# EAGLE design PFC_Method_AirSens_V1 (EAGLE 9.2.2)
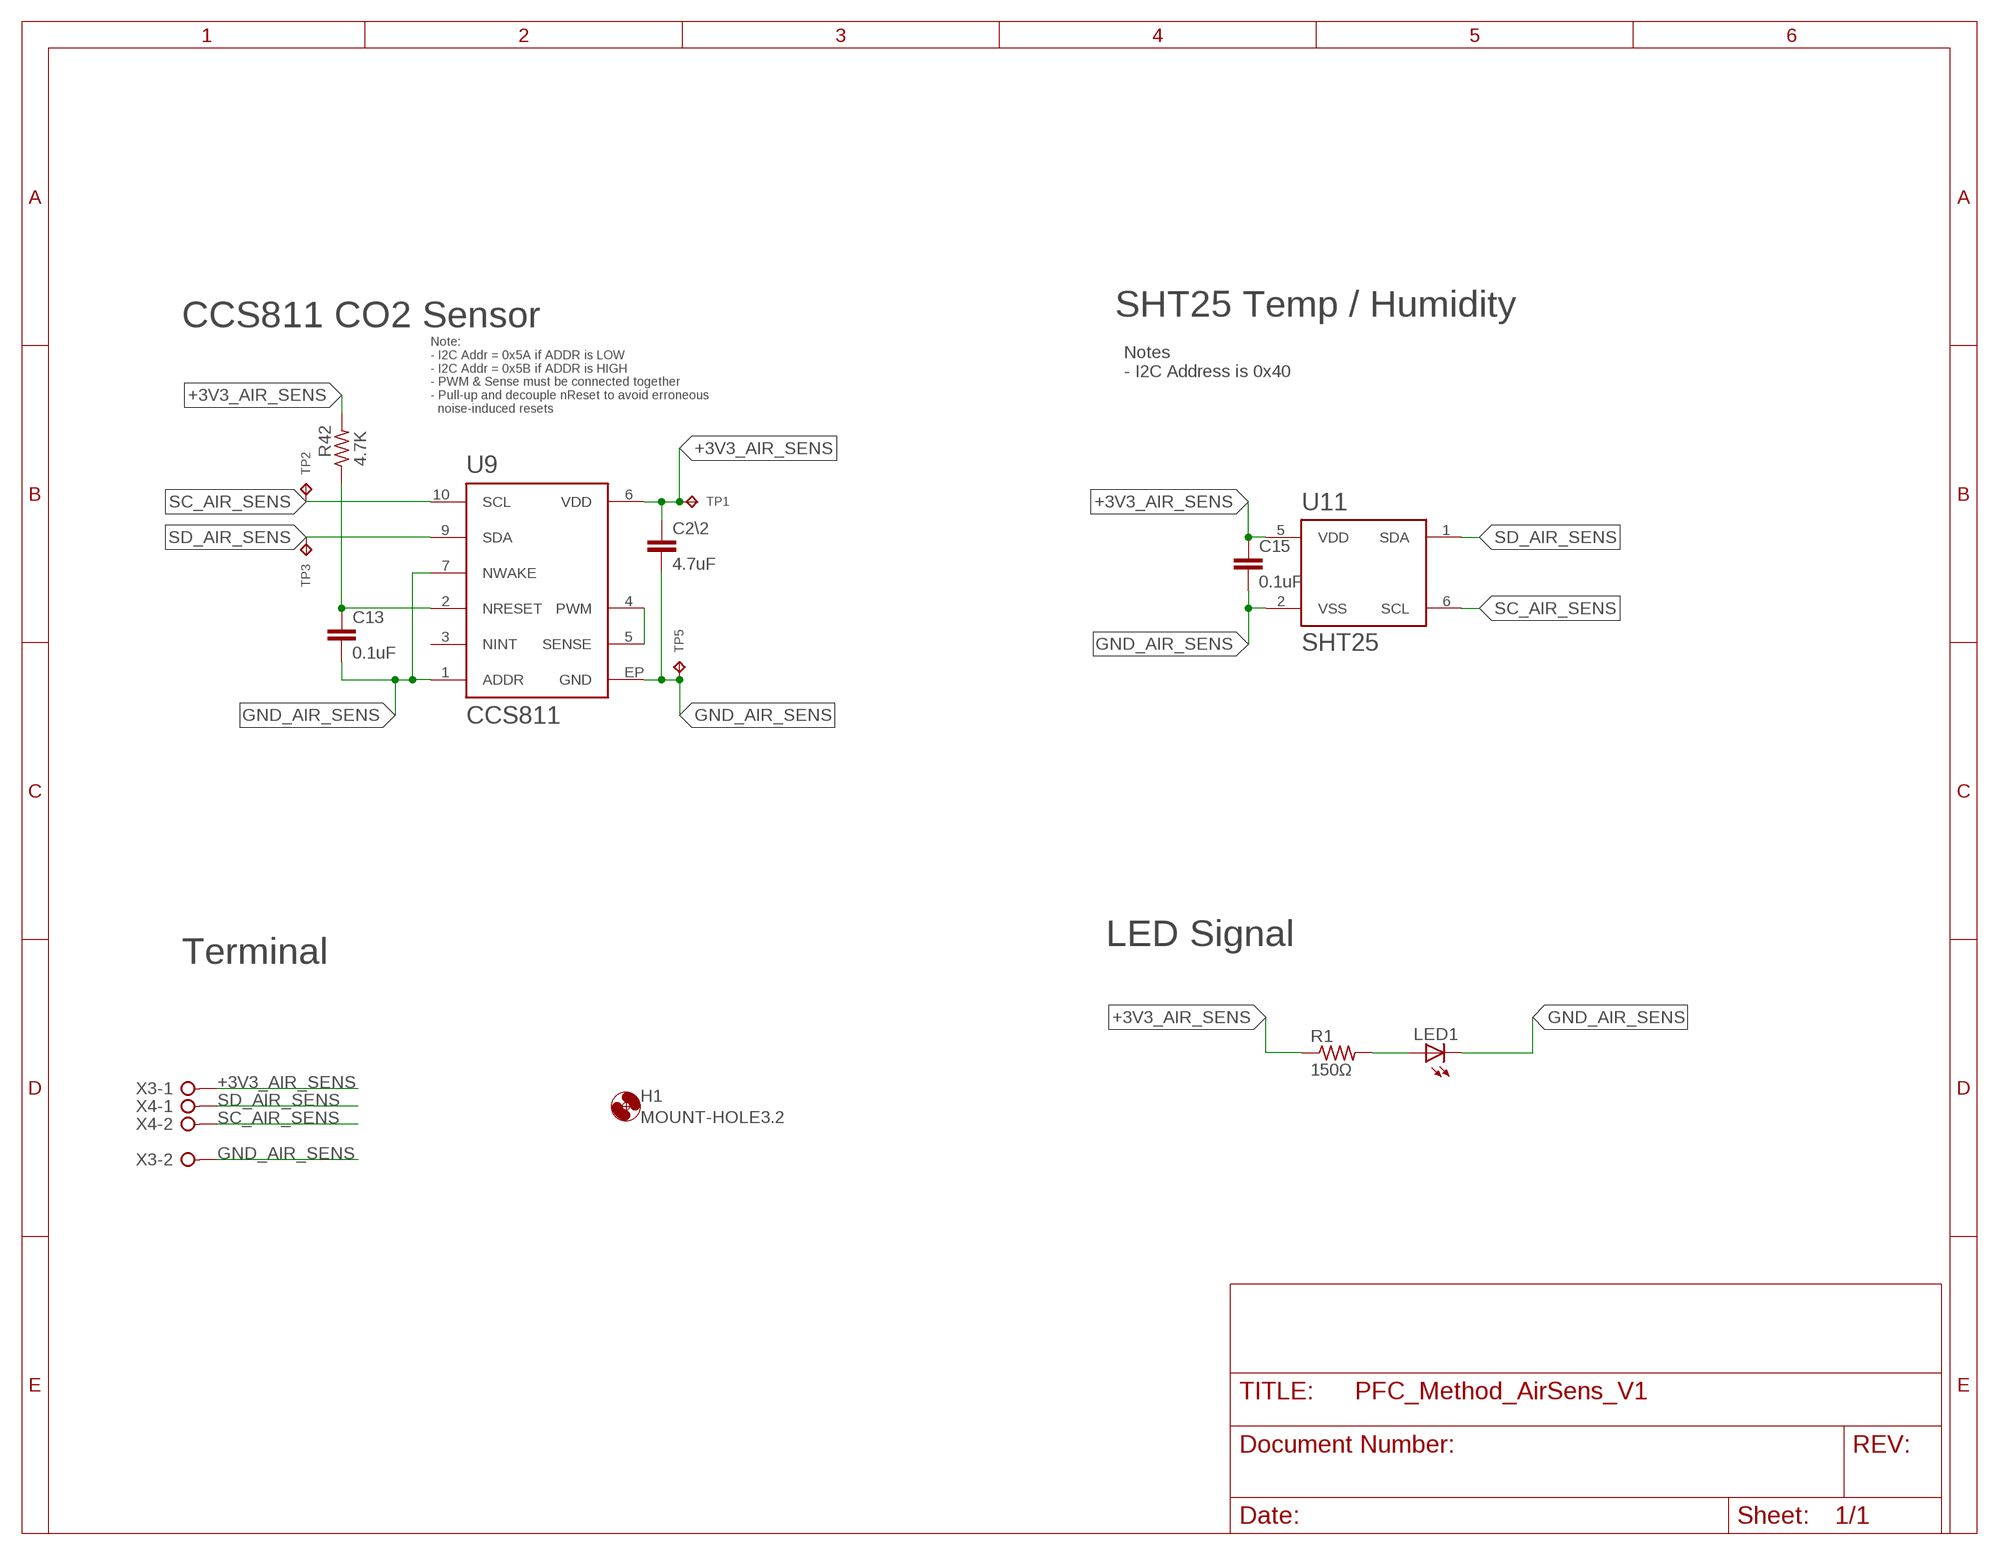
[diagram p0: schematic, sheet 1, part 1 of 2]
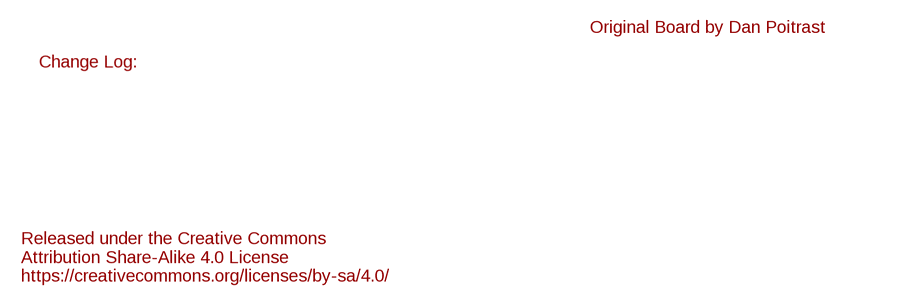
[diagram p1: schematic, sheet 1, part 2 of 2]

## Parts
C2\2  4.7uF  4.7UF-CL21A475KBQNNNE  [C0805]
C13  0.1uF  0.1UF-C0603C104K5RACTU  [C0603]
C15  0.1uF  0.1UF-C0603C104K5RACTU  [C0603]
H1  MOUNT-HOLE3.2  [3,2]
LED1  LED5MM  [LED5MM]
R1  150Ω  R-US_0207/10  [0207/10]
R42  4.7K  4.7K-RC1206JR-074K7L  [R1206]
TP1  TPTP06R  [TP06R]
TP2  TPTP06R  [TP06R]
TP3  TPTP06R  [TP06R]
TP5  TPTP06R  [TP06R]
U9  CCS811  [CCS811]
U11  SHT25  [SHT2X]
X3  W237-02P  [W237-132]
X4  W237-02P  [W237-132]

## Nets
+3V3_AIR_SENS: C2\2.1 C15.1 R1.1 R42.2 TP1.TP U9.6(VDD) U11.5(VDD) X3.1
GND_AIR_SENS: C2\2.2 C13.2 C15.2 LED1.K(C) TP5.TP U9.1(ADDR) U9.7(NWAKE) U9.EP(GND) U11.2(VSS) X3.2
N$1: LED1.A R1.2
N$42: U9.4(PWM) U9.5(SENSE)
N$43: C13.1 R42.1 U9.2(NRESET)
SC_AIR_SENS: TP2.TP U9.10(SCL) U11.6(SCL) X4.2
SD_AIR_SENS: TP3.TP U9.9(SDA) U11.1(SDA) X4.1
Unconnected: U9.3(NINT)

## Notes on the sheet
- SHT25 Temp / Humidity
- CCS811 CO2 Sensor
- Notes
  - I2C Address is 0x40
- Note:
  - I2C Addr = 0x5A if ADDR is LOW
  - I2C Addr = 0x5B if ADDR is HIGH
  - PWM & Sense must be connected together
  - Pull-up and decouple nReset to avoid erroneous
    noise-induced resets
- LED Signal
- Terminal
- Original Board by Dan Poitrast
- Change Log:
- Released under the Creative Commons
  Attribution Share-Alike 4.0 License
  https://creativecommons.org/licenses/by-sa/4.0/

## Library data of the parts
C2\2 = openag-capacitors:4.7UF-CL21A475KBQNNNE: CAP CER 4.7UF 50V X5R 0805 Description: 4.7µF ±10% 50V Ceramic Capacitor X5R 0805 (2012 Metric) Technical Specifications: Capacitance: 4.7uF Tolerance: ±10% Rated Voltage: 50V Temperature Coefficient: X5R Operating Temperature: -55°C ~ 85°C Package/Case: 0805 (2012 Metric) Datasheet(s): CL21A475KBQNNNE Characteristics <http://www.samsungsem.com/kr/front/downloadcms.do?path=/kr/support/product-search/mlcc/__icsFiles/afieldfile/2014/11/05&fileName=C_CL21A475KBQNNNE.pdf> Vendor(s): Digikey: 1276-1248-1-ND <https://www.digikey.com/product-detail/en/samsung-electro-mechanics/CL21A475KBQNNNE/1276-1248-1-ND/3889334>; MANUFACTURER: Samsung; MPN: CL21A475KBQNNNE; VENDOR: Digikey; VLINK: https://www.digikey.com/product-detail/en/samsung-electro-mechanics/CL21A475KBQNNNE/1276-1248-1-ND/3889334; VPN: 1276-1248-1-ND
C13 C15 = openag-capacitors:0.1UF-C0603C104K5RACTU: CAP CER 0.1UF 50V X7R 0603 Description: 0.1µF ±10% 50V Ceramic Capacitor X7R 0603 (1608 Metric) Technical Specifications: Capacitance: 0.1µF Tolerance: ±10% Rated Voltage: 50V Temperature Coefficient: X7R Operating Temperature: -55°C ~ 125°C Package / Case: 0603 (1608 Metric) Datasheet(s): X7R Dielectric, 6.3-250 VDC <https://search.kemet.com/component-edge/download/datasheet/C0603C104K5RACTU.pdf> Vendor(s): Digikey: 399-5089-1-ND <https://www.digikey.com/product-detail/en/kemet/C0603C104K5RACTU/399-5089-1-ND/1465623>; MANUFACTURER: Kemet; MPN: C0603C104K5RACTU; VENDOR: Digikey; VLINK: https://www.digikey.com/product-detail/en/kemet/C0603C104K5RACTU/399-5089-1-ND/1465623; VPN: 399-5089-1-ND
H1 = holes:MOUNT-HOLE: MOUNTING HOLE with drill center marker
LED1 = led:LED: LED OSRAM: - CHIPLED LG R971, LG N971, LY N971, LG Q971, LY Q971, LO R971, LY R971 LH N974, LH R974 LS Q976, LO Q976, LY Q976 LO Q996 - Hyper CHIPLED LW Q18S LB Q993, LB Q99A, LB R99A - SideLED LS A670, LO A670, LY A670, LG A670, LP A670 LB A673, LV A673, LT A673, LW A673 LH A674 LY A675 LS A676, LA A676, LO A676, LY A676, LW A676 LS A679, LY A679, LG A679 - Hyper Micro SIDELED® LS Y876, LA Y876, LO Y876, LY Y876 LT Y87S - SmartLED LW L88C, LW L88S LB L89C, LB L89S, LG L890 LS L89K, LO L89K, LY L89K LS L896, LA L896, LO L896, LY L896 - TOPLED LS T670, LO T670, LY T670, LG T670, LP T670 LSG T670, LSP T670, LSY T670, LOP T670, LYG T670 LG T671, LOG T671, LSG T671 LB T673, LV T673, LT T673, LW T673 LH T674 LS T676, LA T676, LO T676, LY T676, LB T676, LH T676, LSB T676, LW T676 LB T67C, LV T67C, LT T67C, LS T67K, LO T67K, LY T67K, LW E67C LS E67B, LA E67B, LO E67B, LY E67B, LB E67C, LV E67C, LT E67C LW T67C LS T679, LY T679, LG T679 LS T770, LO T770, LY T770, LG T770, LP T770 LB T773, LV T773, LT T773, LW T773 LH T774 LS E675, LA E675, LY E675, LS T675 LS T776, LA T776, LO T776, LY T776, LB T776 LHGB T686 LT T68C, LB T68C - Hyper Mini TOPLED® LB M676 - Mini TOPLED Santana® LG M470 LS M47K, LO M47K, LY M47K Source: http://www.osram.convergy.de LUXEON: - LUMILED® LXK2-PW12-R00, LXK2-PW12-S00, LXK2-PW14-U00, LXK2-PW14-V00 LXK2-PM12-R00, LXK2-PM12-S00, LXK2-PM14-U00 LXK2-PE12-Q00, LXK2-PE12-R00, LXK2-PE12-S00, LXK2-PE14-T00, LXK2-PE14-U00 LXK2-PB12-K00, LXK2-PB12-L00, LXK2-PB12-M00, LXK2-PB14-N00, LXK2-PB14-P00, LXK2-PB14-Q00 LXK2-PR12-L00, LXK2-PR12-M00, LXK2-PR14-Q00, LXK2-PR14-R00 LXK2-PD12-Q00, LXK2-PD12-R00, LXK2-PD12-S00 LXK2-PH12-R00, LXK2-PH12-S00 LXK2-PL12-P00, LXK2-PL12-Q00, LXK2-PL12-R00 Source: www.luxeon.com KINGBRIGHT: KA-3528ASYC Source: www.kingbright.com
R1 = rcl:R-US_: RESISTOR, American symbol; SPICEPREFIX: R
R42 = openag-resistors:4.7K-RC1206JR-074K7L: RES SMD 4.7K OHM 5% 1/4W 1206 Description: 4.7 kOhms ±5% 0.25W, 1/4W Chip Resistor 1206 (3216 Metric) Moisture Resistant Thick Film Technical Specifications: Resistance: 4.7 kOhms Tolerance: ±5% Power (Watts): 0.25W, 1/4W Composition: Thick Film Features: Moisture Resistant Temperature Coefficient: ±100ppm/°C Operating Temperature: -55°C ~ 155°C Package / Case: 1206 (3216 Metric) Supplier Device Package: 1206 Size / Dimension: 0.122" L x 0.063" W (3.10mm x 1.60mm) Height - Seated (Max): 0.026" (0.65mm) Number of Terminations: 2 Datasheet(s): Thick Film Chip Resistor Intro <http://www.yageo.com.tw/exep/pages/download/literatures/PYu-R_INT-thick_7.pdf> Chip Resistor Marking <http://www.yageo.com/exep/pages/download/literatures/PYu-R_Marking_2.pdf> RC Series, L Datasheet <http://www.yageo.com/documents/recent/PYu-RC_Group_51_RoHS_L_8.pdf> Vendor(s): Digikey: 311-4.7KERCT-ND <https://www.digikey.com/product-detail/en/yageo/RC1206JR-074K7L/311-4.7KERCT-ND/732242>; MANUFACTURER: Yageo; MPN: RC1206JR-074K7L; VENDOR: Digikey; VLINK: https://www.digikey.com/product-detail/en/yageo/RC1206JR-074K7L/311-4.7KERCT-ND/732242; VPN: 311-4.7KERCT-ND
TP1-TP3 TP5 = openag-testpads:TP: Test pad; MPN: N/A
U9 = openag-sensors:CCS811: LOW POWER DIGITAL SENSOR FOR IND Description: Air Quality Sensor I²C Technical Specifications: Type: Air Quality Output: I²C Operating Temperature: -5°C ~ 50°C Voltage - Supply: 1.8 V ~ 3.6 V Current - Supply: 26mA Datasheet(s): CCS811 Datasheet <http://ams.com/eng/content/download/951091/2269479/471718> CCS811 Factsheet <http://ams.com/eng/content/view/download/490399> Vendor(s): Digikey: CCS811CT-ND <https://www.digikey.com/product-detail/en/ams/CCS811/CCS811CT-ND/6569300>; MANUFACTURER: ams; MPN: CCS811; VENDOR: Digikey; VLINK: https://www.digikey.com/product-detail/en/ams/CCS811/CCS811CT-ND/6569300; VPN: CCS811CT-ND
U11 = openag-sensors:SHT25: SENSOR HUMI/TEMP 3V I2C 1.8% SMD Description: Humidity Temperature Sensor 0 ~ 100% RH I²C ±1.8% RH 8s Surface Mount Technical Specifications: Sensor Type: Humidity, Temperature Humidity Range: 0 ~ 100% RH Output Type: I²C Output: 12b Accuracy: ±1.8% RH Response Time: 8s Voltage - Supply: 2.1 V ~ 3.6 V Mounting Type: Surface Mount Operating Temperature: -40°C ~ 125°C Datasheet(s): SHTxx Testing Guide <https://www.sensirion.com/fileadmin/user_upload/customers/sensirion/Dokumente/2_Humidity_Sensors/Sensirion_Humidity_Sensors_Testing_Guide_V1.2.pdf> SHTxx Handling Instructions <https://www.sensirion.com/fileadmin/user_upload/customers/sensirion/Dokumente/2_Humidity_Sensors/Sensirion_Humidity_Sensors_Handling_Instructions_V4.pdf> Sensor Specification Statement <https://www.sensirion.com/fileadmin/user_upload/customers/sensirion/Dokumente/2_Humidity_Sensors/Sensirion_Humidity_Sensors_Specification_Statement_V1.pdf> SHTxx, STSxx Assembly SMD Pkgs <https://www.sensirion.com/fileadmin/user_upload/customers/sensirion/Dokumente/2_Humidity_Sensors/Sensirion_Humidity_Sensors_Handling_of_SMD_Packages_V1.pdf> SHT25 Datasheet <https://www.sensirion.com/fileadmin/user_upload/customers/sensirion/Dokumente/2_Humidity_Sensors/Sensirion_Humidity_Sensors_SHT25_Datasheet_V3.pdf> Vendor(s): Digikey: 1649-1008-1-ND <https://www.digikey.com/product-detail/en/sensirion-ag/SHT25/1649-1008-1-ND/5872290>; MANUFACTURER: Sensirion AG; MPN: SHT25; VENDOR: Digikey; VLINK: https://www.digikey.com/product-detail/en/sensirion-ag/SHT25/1649-1008-1-ND/5872290; VPN: 1649-1008-1-ND
X3 X4 = con-wago-508:W237-02P: WAGO SREW CLAMP; OC_FARNELL: unknown; OC_NEWARK: unknown

## Net classes
0 default: width 0.305 mm, drill 0.254 mm, clearance 0.254 mm

## Board
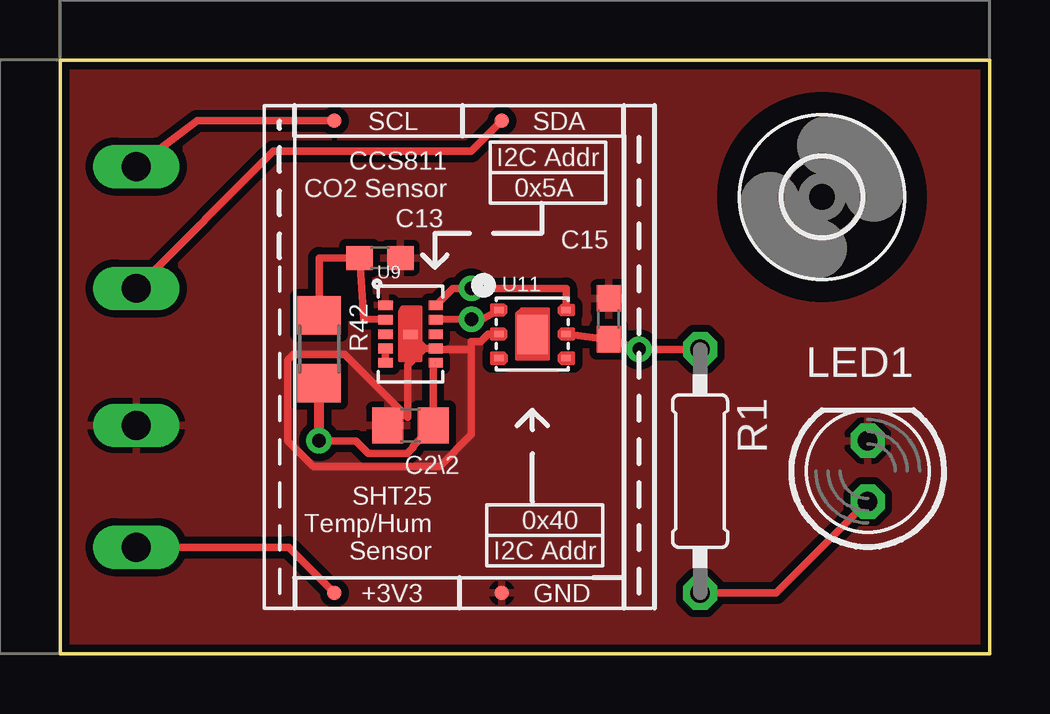
[diagram p2: board, top side]
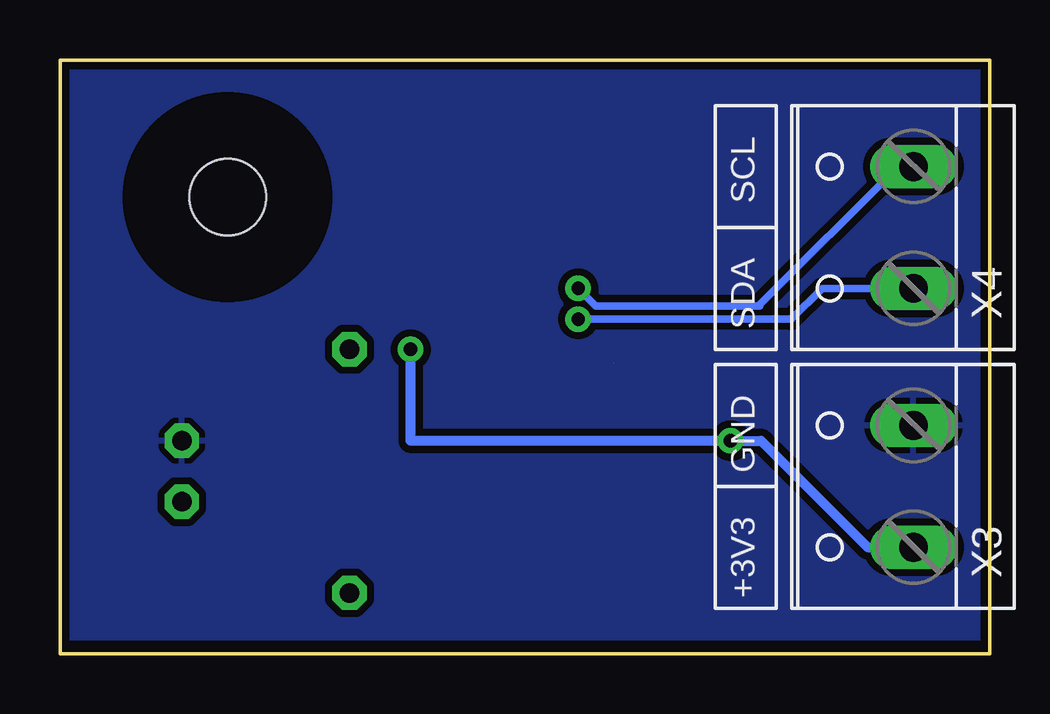
[diagram p3: board, bottom side, seen from below]

Size 38.73 x 24.77 mm. Coordinates in mm from the lower left corner, seen from the top.
Outline: 0,0 0,24.77 38.73,24.77 38.73,0 0,0
Copper layers (1*16): Top 0.035mm / dielectric 1.5mm / Bottom 0.035mm
Design rules "SparkFun": minimum track width 8mil, minimum drill 20mil, track to track 8mil, track to pad 8mil, pad to pad 8mil, via to via 8mil, smd to smd 8mil, copper to edge 8mil, drill to drill 8mil, minimum pad ring 12mil, minimum via ring 10mil, stop-mask expansion 4mil, vias tented up to drill 20mil, thermal gap 10mil

### Footprints (pad centres in the part's own frame; a part is rotated, then mirrored left to right if it is on the bottom)
C0805 = smd 1.3 x 1.5: 1 -0.95,0; 2 0.95,0
C0603 = smd 1.1 x 1: 1 -0.85,0; 2 0.85,0
3,2 = hole 3.2: 0,0
LED5MM = drill 0.813 octagon: A -1.27,0; K 1.27,0
0207/10 = drill 0.813 octagon: 1 -5.08,0; 2 5.08,0
R1206 = smd 1.6 x 1.803: 1 -1.422,0; 2 1.422,0
TP06R = smd 0.6 x 0.6: TP 0,0
CCS811 = smd 0.6 x 0.4: 1 -1.05,1.2; 2 -1.05,0.6; 3 -1.05,0; 4 -1.05,-0.6; 5 -1.05,-1.2; 6 1.05,-1.2; 7 1.05,-0.6; 8 1.05,0; 9 1.05,0.6; 10 1.05,1.2; EP 0,0
SHT2X = smd 0.3 x 0.4: 1 -1,-1.4; 2 0,-1.4; 3 1,-1.4; 4 1,1.4; 5 0,1.4; 6 -1,1.4 | smd 1.651 x 1.27: 7 0,0
W237-132 = drill 1.194 long: 1 -2.54,-0.635; 2 2.54,-0.635

### Placement (x,y rotation side)
C2\2  14.61,9.52 180 top
C13  13.34,16.51 0 top
C15  22.86,13.97 90 top
H1  31.75,19.05 0 top
LED1  33.66,7.62 90 top
R1  26.67,7.62 270 top
R42  10.8,12.7 270 top
TP1  11.43,2.54 0 top
TP2  11.43,22.23 0 top
TP3  18.41,22.23 0 top
TP5  18.41,2.54 0 top
U9  14.61,13.34 0 top
U11  19.68,13.34 270 top
X3  3.81,6.99 90 bottom
X4  3.81,17.78 90 bottom

### Tracks (layer width: path | path; a pad name or v marks a point on that pad's centre or on a via)
+3V3_AIR_SENS  (via drill 0.55)  (1 unrouted)
  Top 0.305: U9.6 15.55,12.03 C2\2.1 14.71,8.68 14.71,8.61 14.47,8.37 12.84,8.37 12.32,8.89 v10.8,8.89 | C15.1 22.98,13.08 | 22.98,13.08 v24.13,12.7 R1.1 | U11.5 22.98,13.08 | X3.1 9.52,4.45 TP1.TP
  Top 0.406: v10.8,8.89 R42.2
  Bottom 0.406: v24.13,12.7 24.13,8.89 v10.8,8.89 9.52,8.89 5.08,4.45 X3.1
GND_AIR_SENS
  Top 0.305: U9.EP | U9.EP 14.26,13.67 | U9.EP 15.2,12.73 U9.7 15.69,12.7 17.14,12.7 | U11.2 17.85,13.34 17.53,13.02 17.14,13.02 17.14,12.7 | 15.18,12.73 14.5,12.05 14.5,9.85 11.86,12.48 9.73,12.48 9.49,12.25 9.49,8.88 10.55,7.81 15.81,7.81 17.14,9.14 17.14,12.7
  pour Top (isolate 0.305): 0,24.77 38.73,24.77 38.73,0 0,0
  pour Bottom (isolate 0.305): 0,24.77 38.73,24.77 38.73,0.63 0,0.63
N$1
  Top 0.305: LED1.A 29.85,2.54 R1.2
N$42
  Top 0.305: U9.4 U9.5
N$43
  Top 0.305: 10.95,14.12 R42.1 10.8,16.51 C13.1 12.66,13.97 U9.2
SC_AIR_SENS  (via drill 0.55)
  Top 0.305: U9.10 16.36,15.24 v17.14,15.24 21.09,15.24 U11.6 | X4.2 5.72,22.23 TP2.TP
  Bottom 0.305: v17.14,15.24 16.42,14.51 9.57,14.51 9.57,14.56 3.81,20.32 X4.2
SD_AIR_SENS  (via drill 0.55)
  Top 0.305: U9.9 v17.14,13.95 17.62,13.96 U11.1 | X4.1 8.89,20.96 17.14,20.96 TP3.TP
  Bottom 0.305: v17.14,13.95 8.27,13.95 6.99,15.24 X4.1

### Text on the board
tPlace: SCL | SDA | CCS811 / CO2 Sensor | I2C Addr | 0x5A | SHT25 / Temp/Hum / Sensor | 0x40 | I2C Addr | +3V3 | GND
bPlace: SCL | SDA | GND | +3V3